# EAGLE design Controller_Nano_1.5 (EAGLE 6.4)
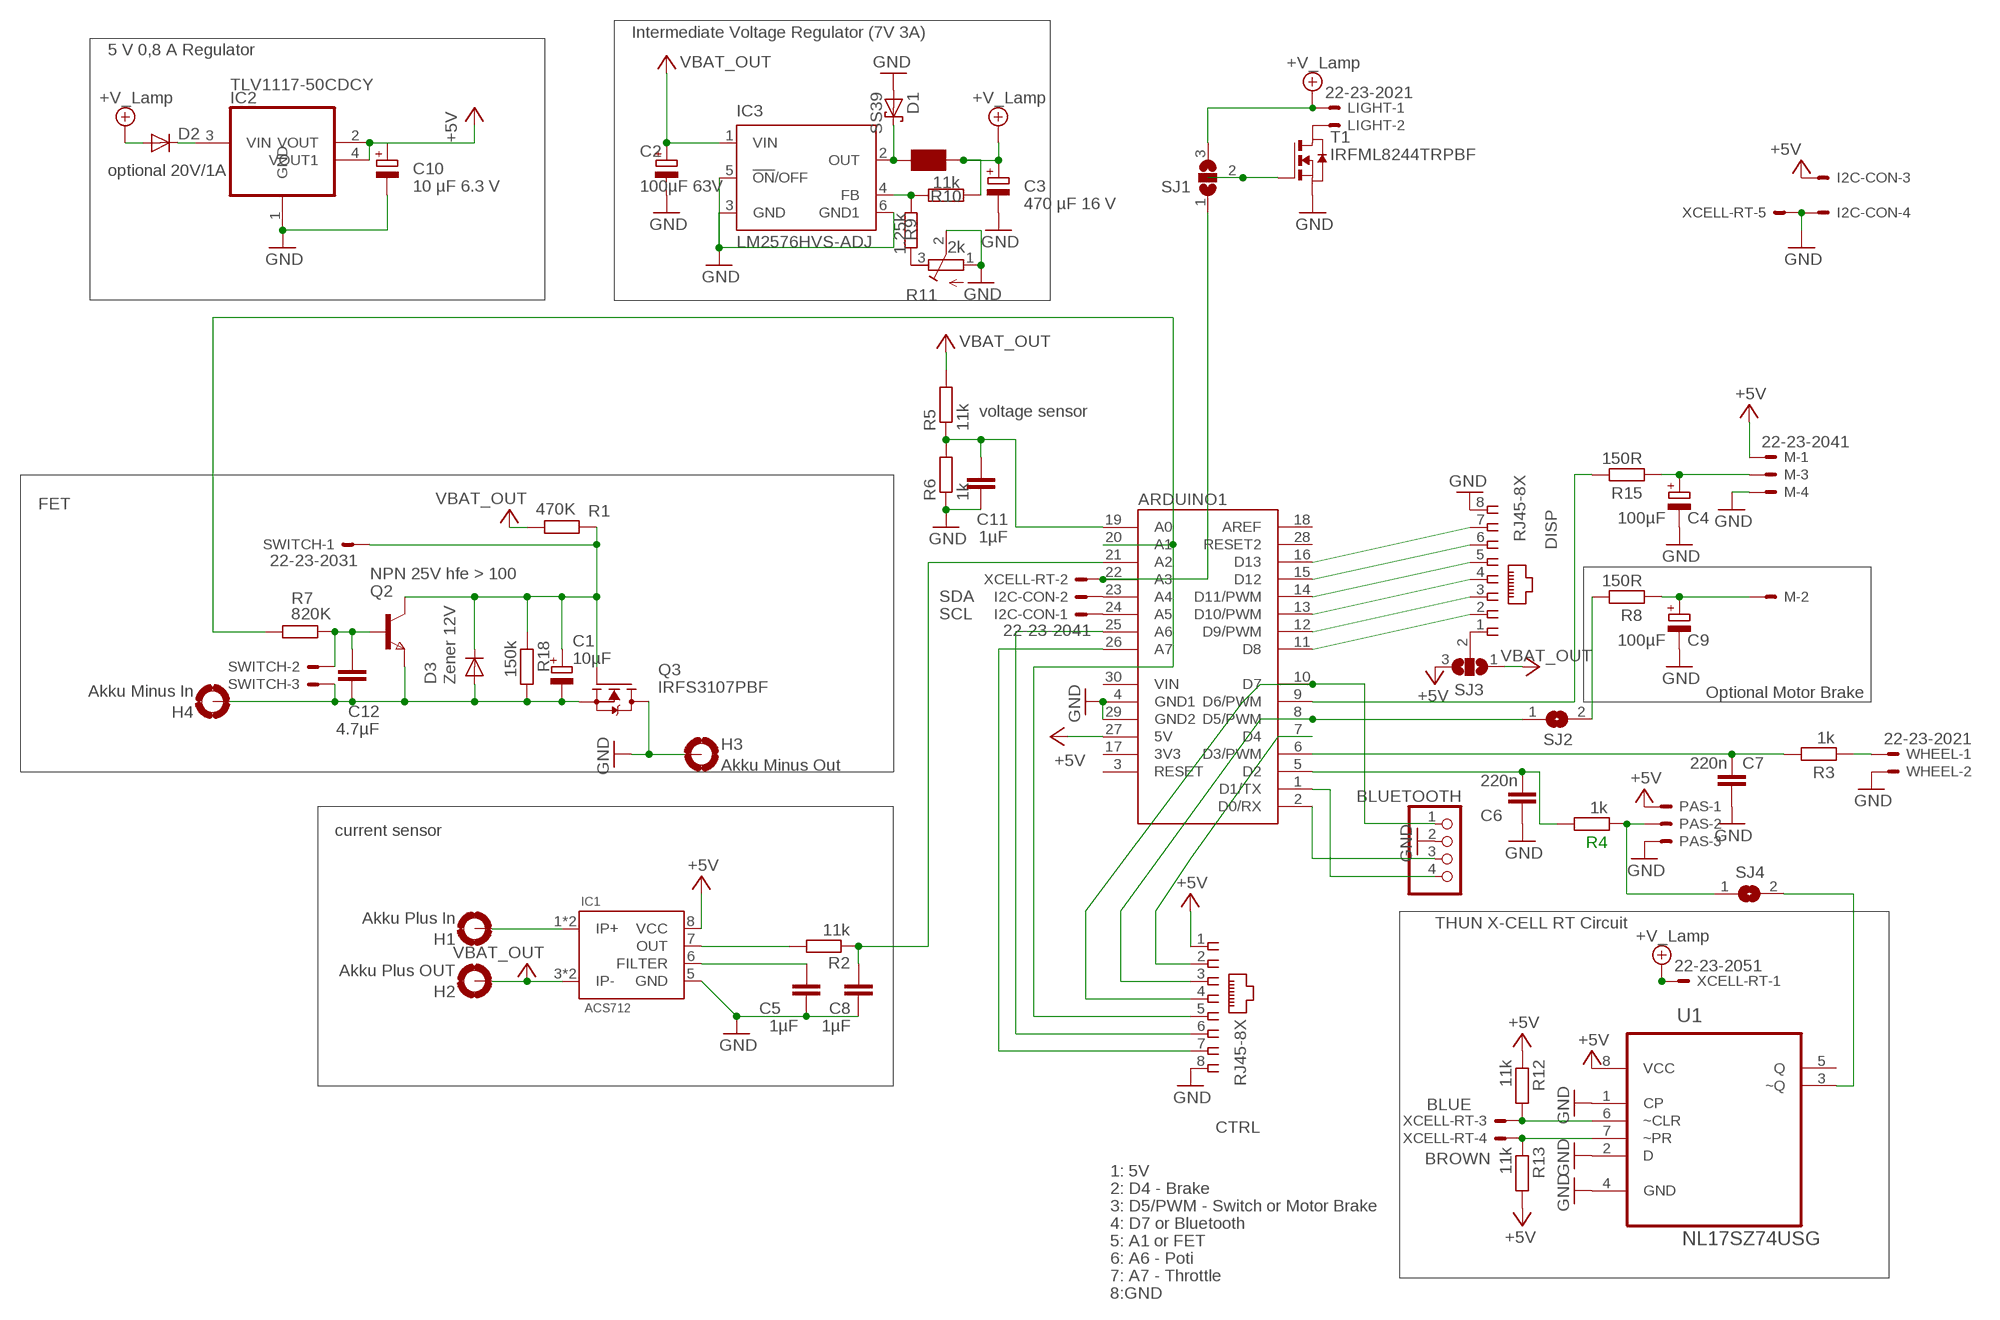
[diagram p0: schematic, sheet 1]

## Parts
ARDUINO1  ARDUINO_NANO_CHECKED  [ARDUINO_NANO_CHECKED]
BLUETOOTH  PINHD-1X4  [1X04]
C1  10µF  CPOL-EUE2-5  [E2-5]
C2  100µF 63V  CPOL-EUE3.5-8  [E3,5-8]
C3  470 µF 16 V  CPOL-EUE3.5-8  [E3,5-8]
C4  100µF  CPOL-EUE2-5  [E2-5]
C5  1µF  C-EUC0805  [C0805]
C6  220n  C-EUC0805  [C0805]
C7  220n  C-EUC0805  [C0805]
C8  1µF  C-EUC0805  [C0805]
C9  100µF  CPOL-EUE2-5  [E2-5]
C10  10 µF 6.3 V  CPOL-EUE2-5  [E2-5]
C11  1µF  C-EUC0805  [C0805]
C12  4.7µF  C-EUC0805  [C0805]
CTRL  RJ45-8X  [RJ45-NO-SHIELD]
D1  SS39  SCHOTTKY-DIODESMC  [SMC]
D2  optional 20V/1A  DIODE-DO-214AC  [DO-214AC]
D3  Zener 12V  DIODE-SOD323-W  [SOD323-W]
DISP  RJ45-8X  [RJ45-NO-SHIELD]
H1  Akku Plus In  MOUNT-PAD-ROUND2.8  [2,8-PAD]
H2  Akku Plus OUT  MOUNT-PAD-ROUND2.8  [2,8-PAD]
H3  Akku Minus Out  MOUNT-PAD-ROUND2.8  [2,8-PAD]
H4  Akku Minus In  MOUNT-PAD-ROUND2.8  [2,8-PAD]
I2C-CON  22-23-2041  [22-23-2041]
IC1  ACS712  MARTIN-SMD-IC_ACS712  [MARTIN-SMD-IC_SO-8]
IC2  TLV1117-50CDCY  REG1117  [SOT223]
IC3  LM2576HVS-ADJ  LM2596S  [TO263-5]
LIGHT  22-23-2021  [22-23-2021]
M  22-23-2041  [22-23-2041]
PAS  22-23-2031  [22-23-2031]
Q2  NPN 25V hfe > 100  NPNSOT23  [SOT-23]
Q3  IRFS3107PBF  BUK663R7-75C  [TRANSISTOR-FET_TO263]
R1  470K  R-EU_R1206  [R1206]
R2  11k  R-EU_R1206  [R1206]
R3  1k  R-EU_R1206  [R1206]
R4  1k  R-EU_R1206  [R1206]
R5  11k  R-EU_R1206  [R1206]
R6  1k  R-EU_R1206  [R1206]
R7  820K  R-EU_R1206  [R1206]
R8  150R  R-EU_R1206  [R1206]
R9  1.25k  R-EU_R1206  [R1206]
R10  11k  R-EU_R1206  [R1206]
R11  2k  R-TRIMM3103  [RTRIM3103]
R12  11k  R-EU_R1206  [R1206]
R13  11k  R-EU_R1206  [R1206]
R15  150R  R-EU_R1206  [R1206]
R18  150k  R-EU_R1206  [R1206]
SJ1  SJ2WW  [SJ_2W]
SJ2  SJ  [SJ]
SJ3  SJ2WW  [SJ_2W]
SJ4  SJ  [SJ]
SWITCH  22-23-2031  [22-23-2031]
T1  IRFML8244TRPBF  NMOSSOT23  [SOT-23]
U1  NL17SZ74USG  [SOP50P310X90-8N]
U$1  PIST-151  [PIST-151]
WHEEL  22-23-2021  [22-23-2021]
XCELL-RT  22-23-2051  [22-23-2051]

## Nets
+5V: ARDUINO1.27(5V) C10.+ CTRL.1 I2C-CON.3 IC1.8(VCC) IC2.2(VOUT) IC2.4(VOUT1) M.1 PAS.1 R12.1 R13.2 SJ3.3 U1.8(VCC)
+5V/2: C3.+ D2.A LIGHT.1 R10.1 SJ1.3 U$1.P$2 XCELL-RT.1 ; supply symbol labelled +V_Lamp
GND: ARDUINO1.4(GND1) ARDUINO1.29(GND2) BLUETOOTH.2 C2.- C3.- C4.- C5.2 C6.2 C7.2 C8.2 C9.- C10.- C11.2 CTRL.8 D1.A DISP.8 H3.B2,8(MOUNT) I2C-CON.4 IC1.5(GND) IC2.1(GND) IC3.3(GND) IC3.5(!ON!/OFF) IC3.6(GND1) M.4 PAS.3 Q3.2D(D) R6.1 R11.1(E) R11.2(S) T1.2(S) U1.1(CP) U1.2(D) U1.4(GND) WHEEL.2 XCELL-RT.5
N$1: ARDUINO1.24(A5) I2C-CON.1
N$2: ARDUINO1.23(A4) I2C-CON.2
N$3: ARDUINO1.20(A1) CTRL.5 R7.2
N$4: ARDUINO1.16(D13) DISP.7
N$5: ARDUINO1.15(D12) DISP.6
N$6: ARDUINO1.14(D11/PWM) DISP.5
N$7: ARDUINO1.13(D10/PWM) DISP.4
N$8: ARDUINO1.12(D9/PWM) DISP.3
N$9: ARDUINO1.9(D6/PWM) R15.2
N$10: IC3.4(FB) R9.2 R10.2
N$11: LIGHT.2 T1.1(D)
N$12: C1.- C12.2 D3.A H4.B2,8(MOUNT) Q2.2(E) Q3.3S(S) R18.2 SWITCH.3
N$13: C1.+ D3.C Q2.1(C) Q3.1G(G) R1.2 R18.1 SWITCH.1
N$14: R3.1 WHEEL.1
N$15: D1.C IC3.2(OUT) U$1.P$1
N$16: C5.1 IC1.6(FILTER)
N$17: ARDUINO1.19(A0) C11.1 R5.1 R6.2
N$18: ARDUINO1.22(A3) SJ1.1 XCELL-RT.2
N$19: ARDUINO1.7(D4) CTRL.2
N$20: ARDUINO1.8(D5/PWM) CTRL.3 SJ2.1
N$21: ARDUINO1.10(D7) BLUETOOTH.1 CTRL.4
N$22: C12.1 Q2.3(B) R7.1 SWITCH.2
N$23: ARDUINO1.11(D8) DISP.2
N$24: ARDUINO1.5(D2) C6.1 R4.2
N$25: IC1.7(OUT) R2.2
N$26: ARDUINO1.2(D0/RX) BLUETOOTH.3
N$27: ARDUINO1.25(A6) CTRL.6
N$28: ARDUINO1.26(A7) CTRL.7
N$29: ARDUINO1.1(D1/TX) BLUETOOTH.4
N$30: C9.+ M.2 R8.1
N$31: C4.+ M.3 R15.1
N$32: PAS.2 R4.1 SJ4.1
N$33: ARDUINO1.6(D3/PWM) C7.1 R3.2
N$34: DISP.1 SJ3.2
N$35: ARDUINO1.21(A2) C8.1 R2.1
N$36: SJ1.2 T1.3(G)
N$37: D2.C IC2.3(VIN)
N$38: R8.2 SJ2.2
N$39: R9.1 R11.3(A)
N$40: R12.2 U1.6(~CLR) XCELL-RT.3
N$41: R13.1 U1.7(~PR) XCELL-RT.4
N$43: SJ4.2 U1.3(~Q)
VBAT_IN: H1.B2,8(MOUNT) IC1.1(IP+) IC1.2(IP+)
VBAT_OUT: C2.+ H2.B2,8(MOUNT) IC1.3(IP-) IC1.4(IP-) IC3.1(VIN) R1.1 R5.2 SJ3.1
Unconnected: ARDUINO1.3(RESET) ARDUINO1.18(AREF) ARDUINO1.28(RESET2) ARDUINO1.30(VIN) U1.5(Q)

## Notes on the sheet
- Intermediate Voltage Regulator (7V 3A)
- 5 V 0,8 A Regulator
- voltage sensor
- FET
- SDA
- SCL
- Optional Motor Brake
- current sensor
- THUN X-CELL RT Circuit
- BLUE
- BROWN
- 1: 5V
- 2: D4 - Brake
- 3: D5/PWM - Switch or Motor Brake
- 4: D7 or Bluetooth
- 5: A1 or FET
- 6: A6 - Poti
- 7: A7 - Throttle
- 8:GND

## Power pins joined to a net without a drawn wire
3V3: ARDUINO1.17(3V3)

## Library data of the parts
ARDUINO1 = arduino_checked:ARDUINO_NANO_CHECKED: Arduino Nano I/O pin arrangement
BLUETOOTH = pinhead:PINHD-1X4: PIN HEADER
C1-C4 C9 C10 = rcl:CPOL-EU: POLARIZED CAPACITOR, European symbol
C5-C8 C11 C12 = rcl:C-EU: CAPACITOR, European symbol
CTRL DISP = con-tycoelectronics:RJ45: CORCOM Modular RJ Jacks No Shield Source: www.tycoelectronics.com .. ENG_DS_1654001_1099_RJ_L_0507.pdf; MPN: RJ45-8X; OC_FARNELL: unknown; OC_NEWARK: 16R6101
D1 = diode:SCHOTTKY-DIODE: Schottky Diode
D2 D3 = diode:DIODE-: DIODE
H1-H4 = holes:MOUNT-PAD-ROUND: MOUNTING PAD, round
I2C-CON M = con-molex:22-23-2041: .100" (2.54mm) Center Header - 4 Pin; MF: MOLEX; MPN: 22-23-2041; OC_FARNELL: 1462920; OC_NEWARK: 38C0355
IC1 = Allegro_ACS712:MARTIN-SMD-IC_ACS712
IC2 = burr-brown:REG1117: 800mA and 1A Low Dropout (LDO) Positive Regulator 1.8V, 2.5V, 2.85V, 3.3V, 5V, and Adj; MPN: REG1117; OC_FARNELL: 1097566; OC_NEWARK: 14P6981
IC3 = national-semiconductor:LM2596: SIMPLE SWITCHER® Power Converter 150 kHz 3A Step-Down Voltage Regulator Source: http://www.national.com/ds/LM/LM2596.pdf; MF: NATIONAL SEMICONDUCTOR; MPN: LM2596S-ADJ/NOPB; OC_FARNELL: 9494367; OC_NEWARK: 41K3842
LIGHT WHEEL = con-molex:22-23-2021: .100" (2.54mm) Center Header - 2 Pin; MF: MOLEX; MPN: 22-23-2021; OC_FARNELL: 1462926; OC_NEWARK: 25C3832
PAS SWITCH = con-molex:22-23-2031: .100" (2.54mm) Center Header - 3 Pin; MF: MOLEX; MPN: 22-23-2031; OC_FARNELL: 1462950; OC_NEWARK: 30C0862
Q2 = zetex:NPNSOT23: NPN TRANSISTOR; MPN: DSS20201L-7; OC_FARNELL: 1710688; OC_NEWARK: 25R4555
Q3 = N-Fet-TO263-D2Pak:BUK663R7-75C: BUK663R7-75C
R1-R10 R12 R13 R15 R18 = resistor:R-EU_: RESISTOR, European symbol
R11 = rcl:R-TRIMM: Trimm resistor
SJ1 SJ3 = jumper:SJ2W: SMD solder JUMPER
SJ2 SJ4 = jumper:SJ: SMD solder JUMPER
T1 = zetex:NMOSSOT23: MOS FET; OC_FARNELL: unknown; OC_NEWARK: unknown
U1 = NL17SZ74USG:NL17SZ74USG: Single D Flip Flop; MPN: NL17SZ74USG; OC_FARNELL: 1468778; OC_NEWARK: 83H7737; PACKAGE: SO-8; SUPPLIER: ON SEMICONDUCTOR
U$1 = Fastron-PIST-151:PIST-151
XCELL-RT = con-molex:22-23-2051: .100" (2.54mm) Center Header - 5 Pin; MF: MOLEX; MPN: 22-23-2051; OC_FARNELL: 1462952; OC_NEWARK: 38C9178

## Net classes
1 clearance: clearance 2.54 mm

## Board
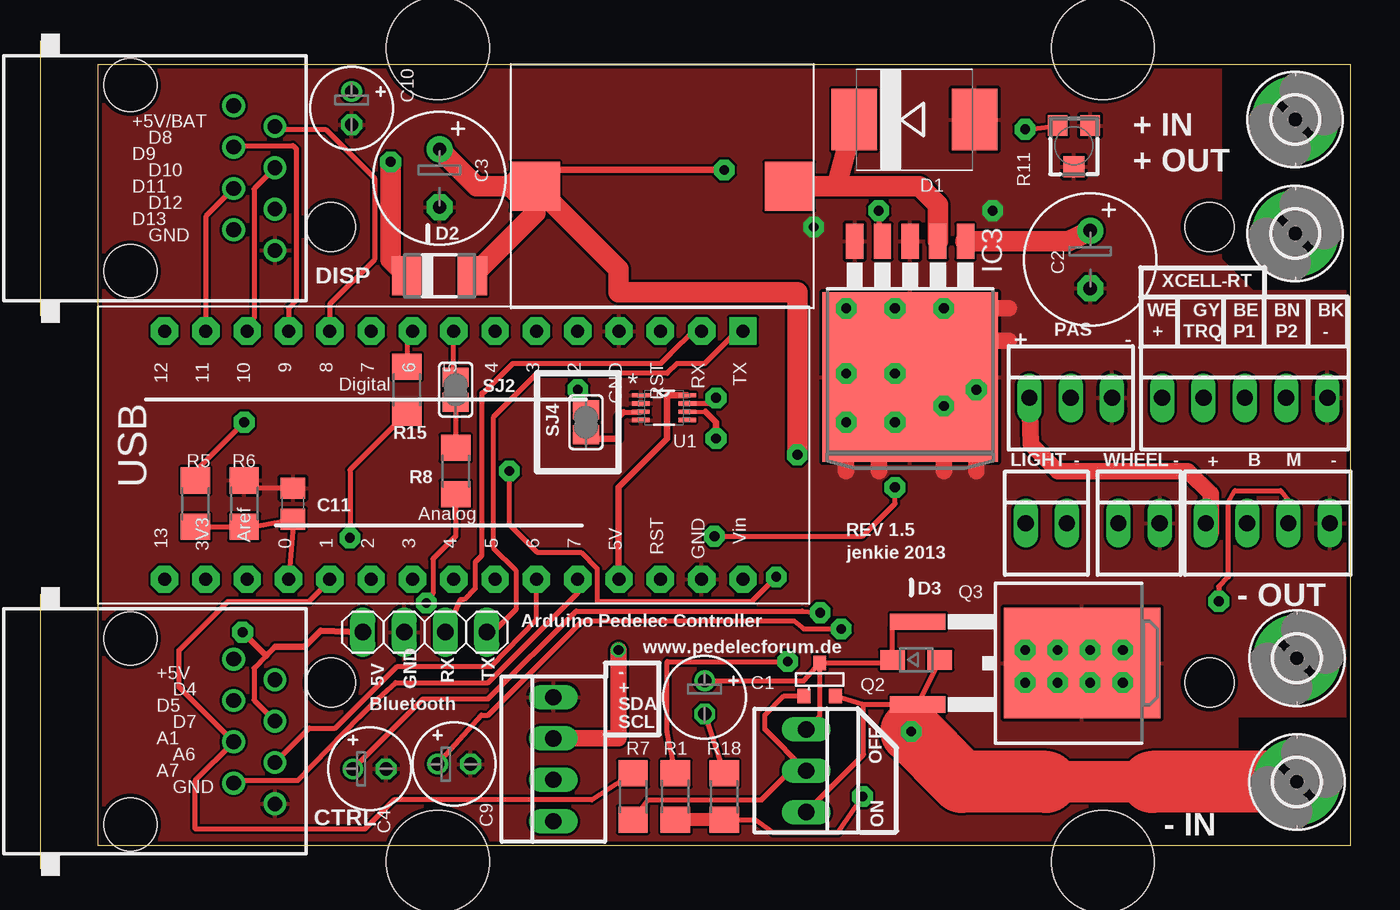
[diagram p1: board, top side]
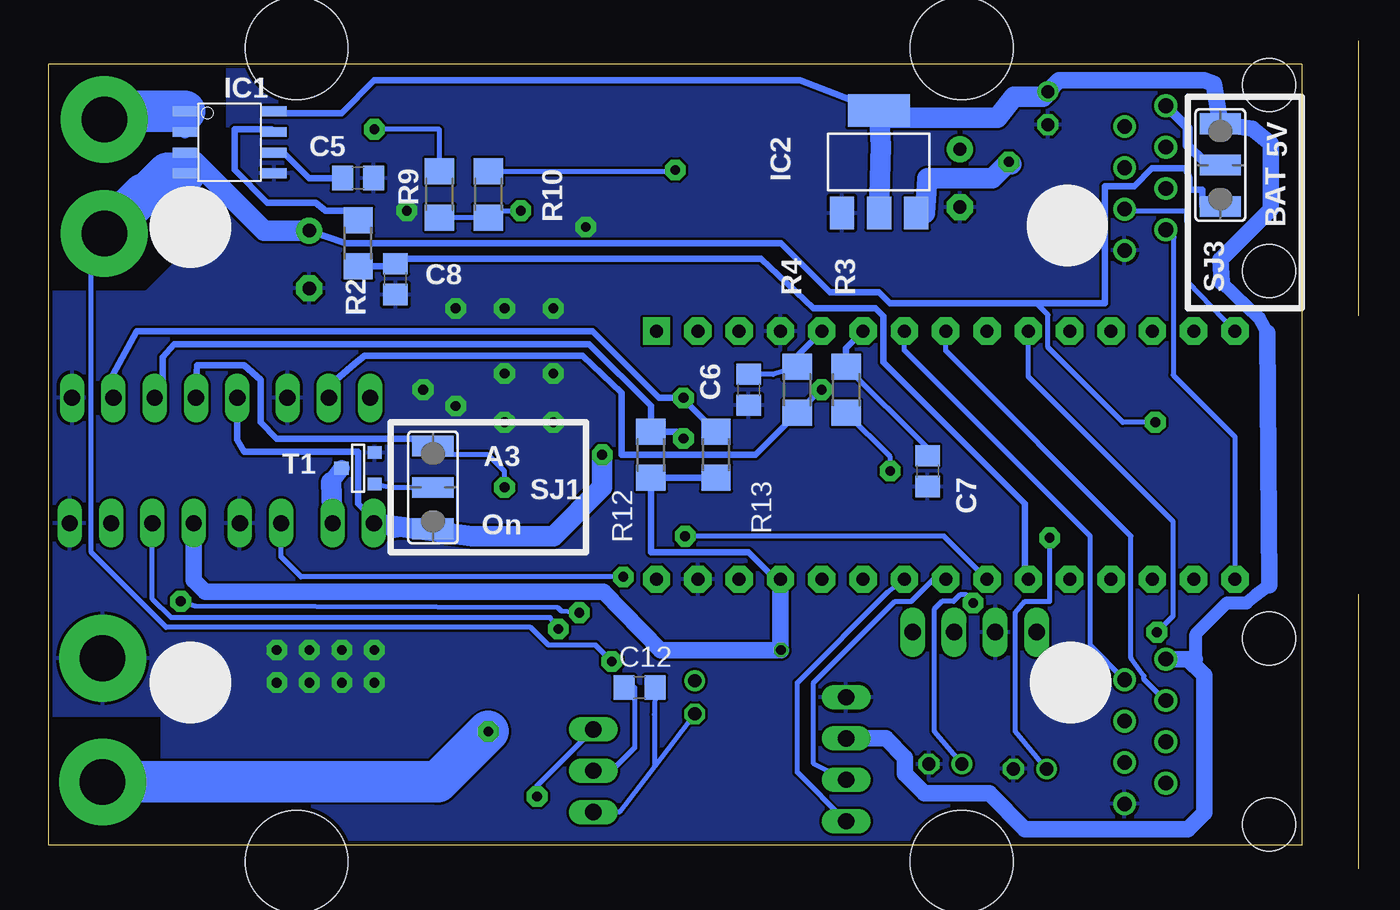
[diagram p2: board, bottom side, seen from below]

Size 77 x 48 mm. Coordinates in mm from the lower left corner, seen from the top.
Outline: 0,0 77,0 77,48 0,48 0,0
Copper layers (1*16): Top 0.018mm / dielectric 1.55mm / Bottom 0.018mm
Design rules "eC_2Layer_PClass6_BaseCopperO18_eCDefault": minimum track width 0.15mm, minimum drill 0.35mm, track to track 0.15mm, track to pad 0.15mm, pad to pad 0.15mm, via to via 0.15mm, smd to smd 0mil, copper to edge 0.25mm, drill to drill 0.35mm, minimum pad ring 0.175mm, minimum via ring 0.125mm, stop-mask expansion 0mil, vias tented up to drill 0.45mm, thermal gap 0.2mm
bRestrict: area 52,20.2 to 55,21.2

### Footprints (pad centres in the part's own frame; a part is rotated, then mirrored left to right if it is on the bottom)
ARDUINO_NANO_CHECKED = drill 0.8 pad 1.676 square: 1 0,-2.54 | drill 0.8 pad 1.676 octagon: 2 0,-5.08; 3 0,-7.62; 4 0,-10.16; 5 0,-12.7; 6 0,-15.24; 7 0,-17.78; 8 0,-20.32; 9 0,-22.86; 10 0,-25.4; 11 0,-27.94; 12 0,-30.48; 13 0,-33.02; 14 0,-35.56; 15 0,-38.1; 16 15.24,-38.1; 17 15.24,-35.56; 18 15.24,-33.02; 19 15.24,-30.48; 20 15.24,-27.94; 21 15.24,-25.4; 22 15.24,-22.86; 23 15.24,-20.32; 24 15.24,-17.78; 25 15.24,-15.24; 26 15.24,-12.7; 27 15.24,-10.16; 28 15.24,-7.62; 29 15.24,-5.08; 30 15.24,-2.54
1X04 = drill 1.016 long: 1 -3.81,0; 2 -1.27,0; 3 1.27,0; 4 3.81,0
E2-5 = drill 0.813 pad 1.27: + -1.016,0 | drill 0.813 pad 1.27 octagon: - 1.016,0
E3,5-8 = drill 0.813 pad 1.6: + -1.778,0 | drill 0.813 pad 1.6 octagon: - 1.778,0
C0805 = smd 1.3 x 1.5: 1 -0.95,0; 2 0.95,0
RJ45-NO-SHIELD = drill 0.9 pad 1.4: 1 -4.445,6.35; 2 -3.175,8.89; 3 -1.905,6.35; 4 -0.635,8.89; 5 0.635,6.35; 6 1.905,8.89; 7 3.175,6.35; 8 4.445,8.89 | hole 3.251: -5.715,0; 5.715,0
SMC = smd 2.8 x 3.8: A 3.7,0; C -3.7,0
DO-214AC = smd 1.8 x 2.4: A 2.025,0; C -2.025,0
SOD323-W = smd 1.5 x 1.2: A 1.45,0; C -1.45,0
2,8-PAD = drill 2.8 pad 5.334: B2,8 0,0
22-23-2041 = drill 1 long: 1 -3.81,0; 2 -1.27,0; 3 1.27,0; 4 3.81,0
MARTIN-SMD-IC_SO-8 = smd 0.61 x 1.524: 1 -1.905,-2.743; 2 -0.635,-2.743; 3 0.635,-2.743; 4 1.905,-2.743; 5 1.905,2.743; 6 0.635,2.743; 7 -0.635,2.743; 8 -1.905,2.743
SOT223 = smd 1.499 x 2.007: 1 -2.261,-3.15; 2 0.025,-3.15; 3 2.311,-3.15 | smd 3.81 x 2.007: 4 0,3.15
TO263-5 = smd 1.067 x 2.159: 1 -3.404,-5.791; 2 -1.702,-5.791; 3 0,-5.791; 4 1.702,-5.791; 5 3.404,-5.791 | smd 10.8 x 10.41: 6 0,2.54
22-23-2021 = drill 1 long: 1 -1.27,0; 2 1.27,0
22-23-2031 = drill 1 long: 1 -2.54,0; 2 0,0; 3 2.54,0
SOT-23 = smd 0.787 x 0.889: 1 0.025,-1.016; 2 -0.94,1.016; 3 0.991,1.016
TRANSISTOR-FET_TO263 = smd 1 x 3.4: 1G -2.54,-6.6; 3S 2.54,-6.6 | smd 6.8 x 9.6: 2D 0,3.5
R1206 = smd 1.6 x 1.803: 1 -1.422,0; 2 1.422,0
RTRIM3103 = smd 1.2 x 1.25: 1 -1,-1.225; 3 1,-1.225 | smd 1.3 x 1.3: 2 0,1.3
SJ_2W = smd 1.27 x 2.54: 1 -2.54,0; 2 0,0; 3 2.54,0
SJ = smd 1.168 x 1.6: 1 -0.762,0; 2 0.762,0
SOP50P310X90-8N = smd 1.067 x 0.254: 1 -1.422,0.762; 2 -1.422,0.254; 3 -1.422,-0.254; 4 -1.422,-0.762; 5 1.422,-0.762; 6 1.422,-0.254; 7 1.422,0.254; 8 1.422,0.762
PIST-151 = smd 3 x 3: P$1 1.5,0.5; P$2 17.1,0.5
1593L = hole 3: 14.33,14; 14.33,-14; 68.33,14; 68.33,-14 | hole 6.3: 20.9,25; 20.9,-25; 61.77,25; 61.77,-25
22-23-2051 = drill 1 long: 1 -5.08,0; 2 -2.54,0; 3 0,0; 4 2.54,0; 5 5.08,0

### Placement (x,y rotation side)
ARDUINO1  42.2,31.6 270 top
BLUETOOTH  20.1,13.1 0 top
C1  37.3,9.1 270 top
C2  61,36 270 top
C3  21,41 270 top
C4  16.7,4.7 0 top
C5  58,41 0 bottom
C6  34,28 270 bottom
C7  23,23 270 bottom
C8  55.7,34.8 270 bottom
C9  21.9,5 0 top
C10  15.6,45.3 270 top
C11  12,21 90 top
C12  40.7,9.7 0 bottom
CTRL  2,7 270 top
D1  50.2,44.6 0 top
D2  21,35 0 top
D3  50.3,11.4 0 top
DISP  2,41 270 top
H1  73.6,44.6 0 top
H2  73.6,37.6 0 top
H3  73.7,11.5 0 top
H4  73.7,3.9 0 top
I2C-CON  28,5.3 90 top
IC1  65.9,43.2 270 bottom
IC2  26,42 0 bottom
IC3  49.93,31.32 180 top
LIGHT  58.3,19.8 0 top
M  71.91,19.8 0 top
PAS  59.8,27.5 0 top
Q2  44.4,10.2 180 top
Q3  57,11.2 270 top
R1  35.5,3 270 top
R2  58,37 90 bottom
R3  28,28 90 bottom
R4  31,28 90 bottom
R5  6,21 90 top
R6  9,21 270 top
R7  32.9,3 90 top
R8  22,23 90 top
R9  53,40 270 bottom
R10  50,40 270 bottom
R11  60,43 180 top
R12  40,24 90 bottom
R13  36,24 270 bottom
R15  19,28 90 top
R18  38.5,3 90 top
SJ1  53.4,22 270 bottom
SJ2  22,28 270 top
SJ3  5,41.8 90 bottom
SJ4  30,26 270 top
SWITCH  43.54,4.59 270 top
T1  58,23.2 270 bottom
U1  34.8,26.9 0 top
U$1  44,41 180 top
U$2  [1593L]  0,24 0 top
WHEEL  64,19.8 0 top
XCELL-RT  70.5,27.5 0 top

### Tracks (layer width: path | path; a pad name or v marks a point on that pad's centre or on a via)
+5V  (via drill 0.6)
  Top 0.406: ARDUINO1.27 32,16.4 32,22 35,25 35,27.66 U1.8
  Top 1.016: PAS.1 57.36,24.64 59,23 67,23 68.4,21.6 68.4,19.2 M.1 | I2C-CON.3 32,6.57 v32,12
  Bottom 0.406: IC1.8 63.05,45 59,45 57,47 30.85,47 IC2.4 | ARDUINO1.27 32.36,16.36 34,18 40,18 R12.1 R13.2
  Bottom 0.813: 6.55,11.45 6.5,11.5 6.5,13 4.6,14.9 3.4,14.9 2.8,15.4 2,16 | 2.1,31.5 2.6,32.4 4.9,34.6
  Bottom 1.016: C10.+ 14.92,47 6,47 5.4,46.8 SJ3.3 3.02,44.02 1.9,43.1 1.9,39.1 5,36 4.9,34.6 | CTRL.1 7,11.45 | 7,11.45 6.55,11.45 | 2,16 2.1,31.5 | I2C-CON.3 25.57,6.57 24.4,5.4 24.4,4.4 23.2,3.2 19.2,3.2 17,1 7,1 6,2 6,10.45 7,11.45 | ARDUINO1.27 32.04,12 v32,12 39.4,12 42.9,15.6 67.4,15.6 68.1,16.3 M.1
  Bottom 1.27: IC2.2 25.88,43 IC2.4 25.85,44.7 18.7,44.7 17.7,46 15.92,46 C10.+
+5V/2  (via drill 0.6 pad 1.27)
  Top 0.406: v38.5,41.5 32.5,41.5 27.5,41.5 27,41 27,40.6 U$1.P$2
  Top 1.27: C3.+ 23.28,40.5 26,40.5 U$1.P$2 | D2.A 26.9,38.88 U$1.P$2 | v43,24 43,34 32,34 32,35.4 U$1.P$2
  Top 2.184: 27,40 26,40.5
  Bottom 0.305: SJ1.3 55.88,19 LIGHT.1 | R10.1 38.42,41.42 v38.5,41.5
  Bottom 0.406: LIGHT.1 57.13,20.13 58,21 58,24.2 65,24.2 65.42,24.92 XCELL-RT.1
  Bottom 1.27: LIGHT.1 51,19 46,19 43,22 v43,24
GND  (via drill 0.6 pad 1.27)
  Top 0.305: C11.2 9.47,21.95 R6.1
  Top 1.016: 55,33 56,33 | 55,31 56,31 | 54,23 54,24 | 52,23 52,24 | 48,23 48,24 | 46,23 46,24
  other vias: 57,12 57,10 59,10 61,10 63,10 59,12 61,12 63,12 46,33 49,33 52,33 46,29 49,29 54,28 46,26 49,26 52,27 55,39 44,38
  pour Top: 0,0 70,0 70,8 77,8 77,34 71,34 69,36 69,48 0,48
  pour Bottom: 0,0 70,0 70,8 77,8 77,34 71,34 66,39 66,48 0,48
N$1
  Bottom 0.305: I2C-CON.1 31,4.49 31,10 25.42,15.58 ARDUINO1.24
N$2
  Bottom 0.305: I2C-CON.2 30,5.03 30,10 25,15 24,15 22.64,16.36 ARDUINO1.23
N$3
  Top 0.305: ARDUINO1.20 14.26,16.26 13,15 8,15 5,12 5,9.71 CTRL.5 8.35,6.35 6,4 6,1 16.4,1 18.2,2.8 30.38,2.8 R7.2
N$4
  Bottom 0.305: 7.9,37.38 7.9,28.9 4.1,25.1 ARDUINO1.16
  Bottom 0.406: DISP.7 7.9,37.38
N$5
  Bottom 0.305: 10.79,39 7.1,39 7,34.6 ARDUINO1.15
  Bottom 0.406: DISP.6 10.79,39
N$6
  Top 0.305: DISP.5 6.64,38.66 ARDUINO1.14
N$7
  Top 0.305: DISP.4 9.6,40.34 9.6,32.4 9.18,31.98 ARDUINO1.13
N$8
  Top 0.305: 8.45,43 12,43 12.2,42.8 12.2,33.5 11.72,33.02 ARDUINO1.12
  Top 0.406: DISP.3 8.45,43
N$9
  Top 0.305: ARDUINO1.9 19,31.26 R15.2
N$10  (via drill 0.6 pad 1.27)
  Top 0.305: v48,39 48,37.11 IC3.4
  Bottom 0.305: v48,39 50,39 R10.2 R9.2
N$11
  Bottom 1.016: T1.1 59.67,22.32
  Bottom 1.27: 59.67,22.32 LIGHT.2
N$12  (via drill 0.6 pad 1.27)
  Top 0.305: D3.A Q3.3S 47.06,8.66 | Q2.2 47.06,8.66 | SWITCH.3 47.06,5.57 47.06,8.66 | C1.- 38,5.98 R18.2
  Top 0.406: v50,7 50,8.26 Q3.3S
  Top 2.54: 64.8,3.9 58.3,3.9
  Top 3.81: H4.B2,8 64.8,3.9 | 58.3,3.9 53.1,3.9 | 53,4 v50,7
  Bottom 0.305: C1.- 39.79,4.84 | 39.79,4.84 41.93,2.05 SWITCH.3 | C12.2 39.79,8.05 39.79,4.84
  Bottom 2.54: v50,7 53.1,3.9 H4.B2,8
N$13  (via drill 0.6 pad 1.27)
  Top 0.305: Q3.1G 49.14,13.74 48.85,13.45 D3.C 48.67,11.22 Q2.1 | SWITCH.1 44.38,7.96 Q2.1 | C1.+ 43.4,10.12 Q2.1 | R18.1 40.42,1.58 41.5,0.8 45.5,0.8 v47,3
  Top 0.813: R18.1 R1.2
  Bottom 0.305: v47,3 47,3.67 SWITCH.1
N$14  (via drill 0.6 pad 1.27)
  Top 0.305: v25.3,23 25.3,19.7 27,18 29.7,18 30.7,17 30.7,15 40.2,15 v41.7,16.5
  Bottom 0.305: R3.1 25.32,23.9 v25.3,23 | v41.7,16.5 61.5,16.5 62.73,17.73 WHEEL.1
N$15
  Top 1.27: D1.C 45.4,40.5 U$1.P$1 50.5,40.5 51,40 51.63,39.37 IC3.2
N$16
  Bottom 0.406: C5.1 61,41 62.56,42.56 IC1.6
N$17
  Top 0.305: ARDUINO1.19 12.03,20.05 C11.1 9.53,19.58 R6.2 R5.1
N$18  (via drill 0.6 pad 1.27)
  Top 0.305: v37.9,19 47,19 49,21 v49,22
  Bottom 0.305: ARDUINO1.22 21.98,19 v37.9,19 | v49,22 49,23 50,24 52.86,24 SJ1.1
  Bottom 0.406: XCELL-RT.2 67.96,28.64 67.9,29.5 65,29.5 64,28.6 64,26 63,25 53.88,25 SJ1.1
N$19
  Bottom 0.305: CTRL.2 13,12.29 13,19 24.42,30.42 ARDUINO1.7
N$20
  Top 0.305: SJ2.1 21.88,28.88 ARDUINO1.8
  Bottom 0.305: ARDUINO1.8 21.88,30.38 10.5,19 10.5,11.5 9.7,10.4 9.7,10.2 8.4,8.9 CTRL.3
N$21  (via drill 0.6 pad 1.27)
  Top 0.305: 10.9,12.2 10.35,11.65 9.6,10.9 9.6,8.93 CTRL.4
  Top 0.406: BLUETOOTH.1 13.7,13.2 12.7,12.2 10.9,12.2 | v8.9,13.1 10.35,11.65
  Bottom 0.305: CTRL.4 10.82,7.7 | ARDUINO1.10 16.8,28.8 7.9,19.9 7.9,14.1 v8.9,13.1
N$22
  Top 0.305: R7.1 33.82,2.8 40.8,2.8 42.59,4.59 SWITCH.2 41,7.13 41,8 42.18,9.18 Q2.3
  Bottom 0.305: C12.1 41,9.7 41,6 42.41,4.59 SWITCH.2
N$23
  Top 0.305: 11.06,44 14,44 17,41 17,36 14.26,33.26 ARDUINO1.11
  Top 0.406: DISP.2 11.06,44
N$24
  Bottom 0.305: R4.2 32.47,28.95 C6.1
  Bottom 0.406: ARDUINO1.5 31,30.1 R4.2
N$25
  Bottom 0.406: IC1.7 63.32,44 65.6,44 65.6,41.5 63.6,39.5 60.6,39.5 60,39 58.58,39 R2.2
N$26
  Top 0.305: ARDUINO1.2 36.6,31.6 35.2,30.2 34.6,29.6 25.5,29.6 24.3,28.4 23.7,27.8 23.6,27.8 23.6,17.8 23.2,17.4 23.2,15.8 22.5,15.1 22.27,15.1 BLUETOOTH.3
N$27
  Top 0.305: CTRL.6 12.99,7.2 14.6,7.2 16.1,8.7 17.2,9.8 18.4,11 24.2,11 26.96,13.86 ARDUINO1.25
N$28
  Top 0.305: CTRL.7 8.53,4 12.3,4 16.1,7.9 17.2,9 18.3,10 24,10 29.5,15.5 ARDUINO1.26
N$29
  Top 0.305: ARDUINO1.1 39.3,31.6 37.3,29.6 35.6,29.6 35,29 27,29 25.6,27.6 | 25.6,27.6 25,27 25.6,27.6 | 25.6,27.6 24.3,26.3 24.3,18.3 25.7,16.9 25.7,14.5 24.4,13.2 BLUETOOTH.4
N$30  (via drill 0.6 pad 1.27)
  Top 0.305: C9.+ 23.58,8 24,8 29.78,13.8 42.8,13.8 43.4,13.3 v45.7,13.3 | R8.1 22,19 20.6,17.6 20.6,15.5 v20.2,14.9
  Bottom 0.305: v20.2,14.9 20.6,15.4 21,15.4 21.4,15 22.1,15 22.6,14.5 22.6,7.02 C9.+ | v45.7,13.3 46.2,14 69.5,14 70.64,15.14 M.2
N$31  (via drill 0.6 pad 1.27)
  Top 0.305: C4.+ 19.98,9 24,9 29.4,14.4 43.3,14.4 v44.4,14.3 | M.3 73.18,21.22 72.7,21.8 69.9,21.8 69.5,21.1 69.5,16.5 68.9,15.9 v68.9,15 | R15.1 15.5,23.08 v15.5,18.9
  Bottom 0.305: v15.5,18.9 15.5,15 17,15 17.6,14.3 17.6,7 C4.+ | v44.4,14.3 45.5,14.4 45.7,14.6 68,14.7 v68.9,15
N$32  (via drill 0.6 pad 1.27)
  Top 0.406: SJ4.1 30,27 v29.5,28
  Bottom 0.406: PAS.2 59.8,28.2 58.2,29.6 57.6,30.1 44.2,30.1 41.8,27.8 41.8,24 33.58,24 R4.1 29.58,28 v29.5,28
N$33
  Bottom 0.305: ARDUINO1.6 27,31.56 | C7.1 23,24.42 R3.2
  Bottom 0.406: 27,31.56 28,30.56 R3.2
N$34
  Bottom 0.61: SJ3.2 6,42 7,43 7,44.09 DISP.1
N$35
  Bottom 0.406: ARDUINO1.21 17,16.56 17,21 25.7,29.7 25.7,32.5 26.2,33 30,33 33.25,36.05 55.4,36.05 C8.1 55.87,35.58 R2.1
N$36
  Bottom 0.305: T1.3 55.99,22 SJ1.2
N$37  (via drill 0.6 pad 1.27)
  Top 1.27: D2.C 18,35.98 v18,42
  Bottom 1.27: 17.85,41.85 v18,42 19,41 23,41 23.15,38.85 IC2.3
N$38
  Top 0.305: SJ2.2 R8.2
N$39  (via drill 0.6 pad 1.27)
  Top 0.305: v57,44 57.23,44 R11.3
  Bottom 0.305: R9.1 53,44 v57,44
N$40  (via drill 0.6 pad 1.27)
  Top 0.254: U1.6 37.35,26.65
  Top 0.406: v38,25 38,26 37.35,26.65
  Bottom 0.406: XCELL-RT.3 70,27.5 70,30 69.3,30.8 43.8,30.8 40,27 R12.2 38.42,25.42 v38,25
N$41  (via drill 0.6 pad 1.27)
  Top 0.305: U1.7 37.65,27.15
  Top 0.406: 37.65,27.15 v38,27.5
  Bottom 0.406: XCELL-RT.4 73.04,28.96 71.6,31.6 43.6,31.6 39.5,27.5 v38,27.5 38,27.42 R13.1
N$43
  Top 0.305: 32.3,26.6 33.33,26.6 U1.3
  Top 0.406: SJ4.2 30.24,25 32,25 32,26.3 32.3,26.6
VBAT_IN
  Bottom 0.813: IC1.1 IC1.2
  Bottom 2.54: H1.B2,8 73.09,45.1 IC1.1
VBAT_OUT  (via drill 0.6 pad 1.27)
  Top 0.305: R1.1 35,7 35,11.3 v42.4,11.3 | R5.2 6,23 v9,26
  Top 1.27: IC3.1 59.67,37.11 C2.+
  Bottom 0.305: v9,26 11,26 15.6,30.6 15.6,32.6 16.3,33.3 17.7,33.3 | v42.4,11.3 43.4,12.3 46.3,12.3 47.4,13.4 69.8,13.4 74.4,18 74.4,36.8 arc90 H2.B2,8
  Bottom 0.406: SJ3.1 6.1,39.26 6.1,40.3 6.9,40.3 6.9,41 7.12,41.6 9.2,41.6 10.3,40.5 12.1,40.5 12.1,33.3 17.7,33.3 25.3,33.3 26,34 29,34 32,37 58.78,37 C2.+
  Bottom 0.61: IC1.4 68.64,42 IC1.3
  Bottom 1.27: 71,40 71.2,40 | C2.+ 63.78,37.78 68,42 68.64,42
  Bottom 2.54: IC1.4 69.7,41.3 71,40 | 71.2,40 H2.B2,8

### Text on the board
tNames: +5V/BAT | + IN | D8 | D9 | D10 | + OUT | D11 | D12 | D13 | GND | WE | GY | BE | BN | BK | + | - | + | TRQ | P1 | P2 | - | - | - | + | B | - | USB | REV 1.5 | jenkie 2013 | - OUT | Arduino Pedelec Controller | www.pedelecforum.de | +5V | 5V | GND | RX | TX | - | - | D4 | + | D5 | Bluetooth | SDA | D7 | SCL | A1 | A6 | OFF | A7 | GND | ON | - IN
bNames: 5V | BAT | A3 | On